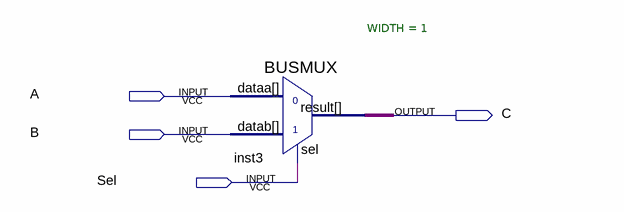
[diagram p0: schematic sheet]
// Quartus schematic mux2x1.bdf as structural Verilog: 1 symbols, 4 pins
module mux2x1 (
  input  A,
  input  B,
  input  Sel,
  output C
);

  BUSMUX #(.WIDTH(1)) inst3 (.datab(B), .sel(Sel), .dataa(A), .result(C));
endmodule
